# EAGLE schematic untitled (EAGLE 9.6.2)
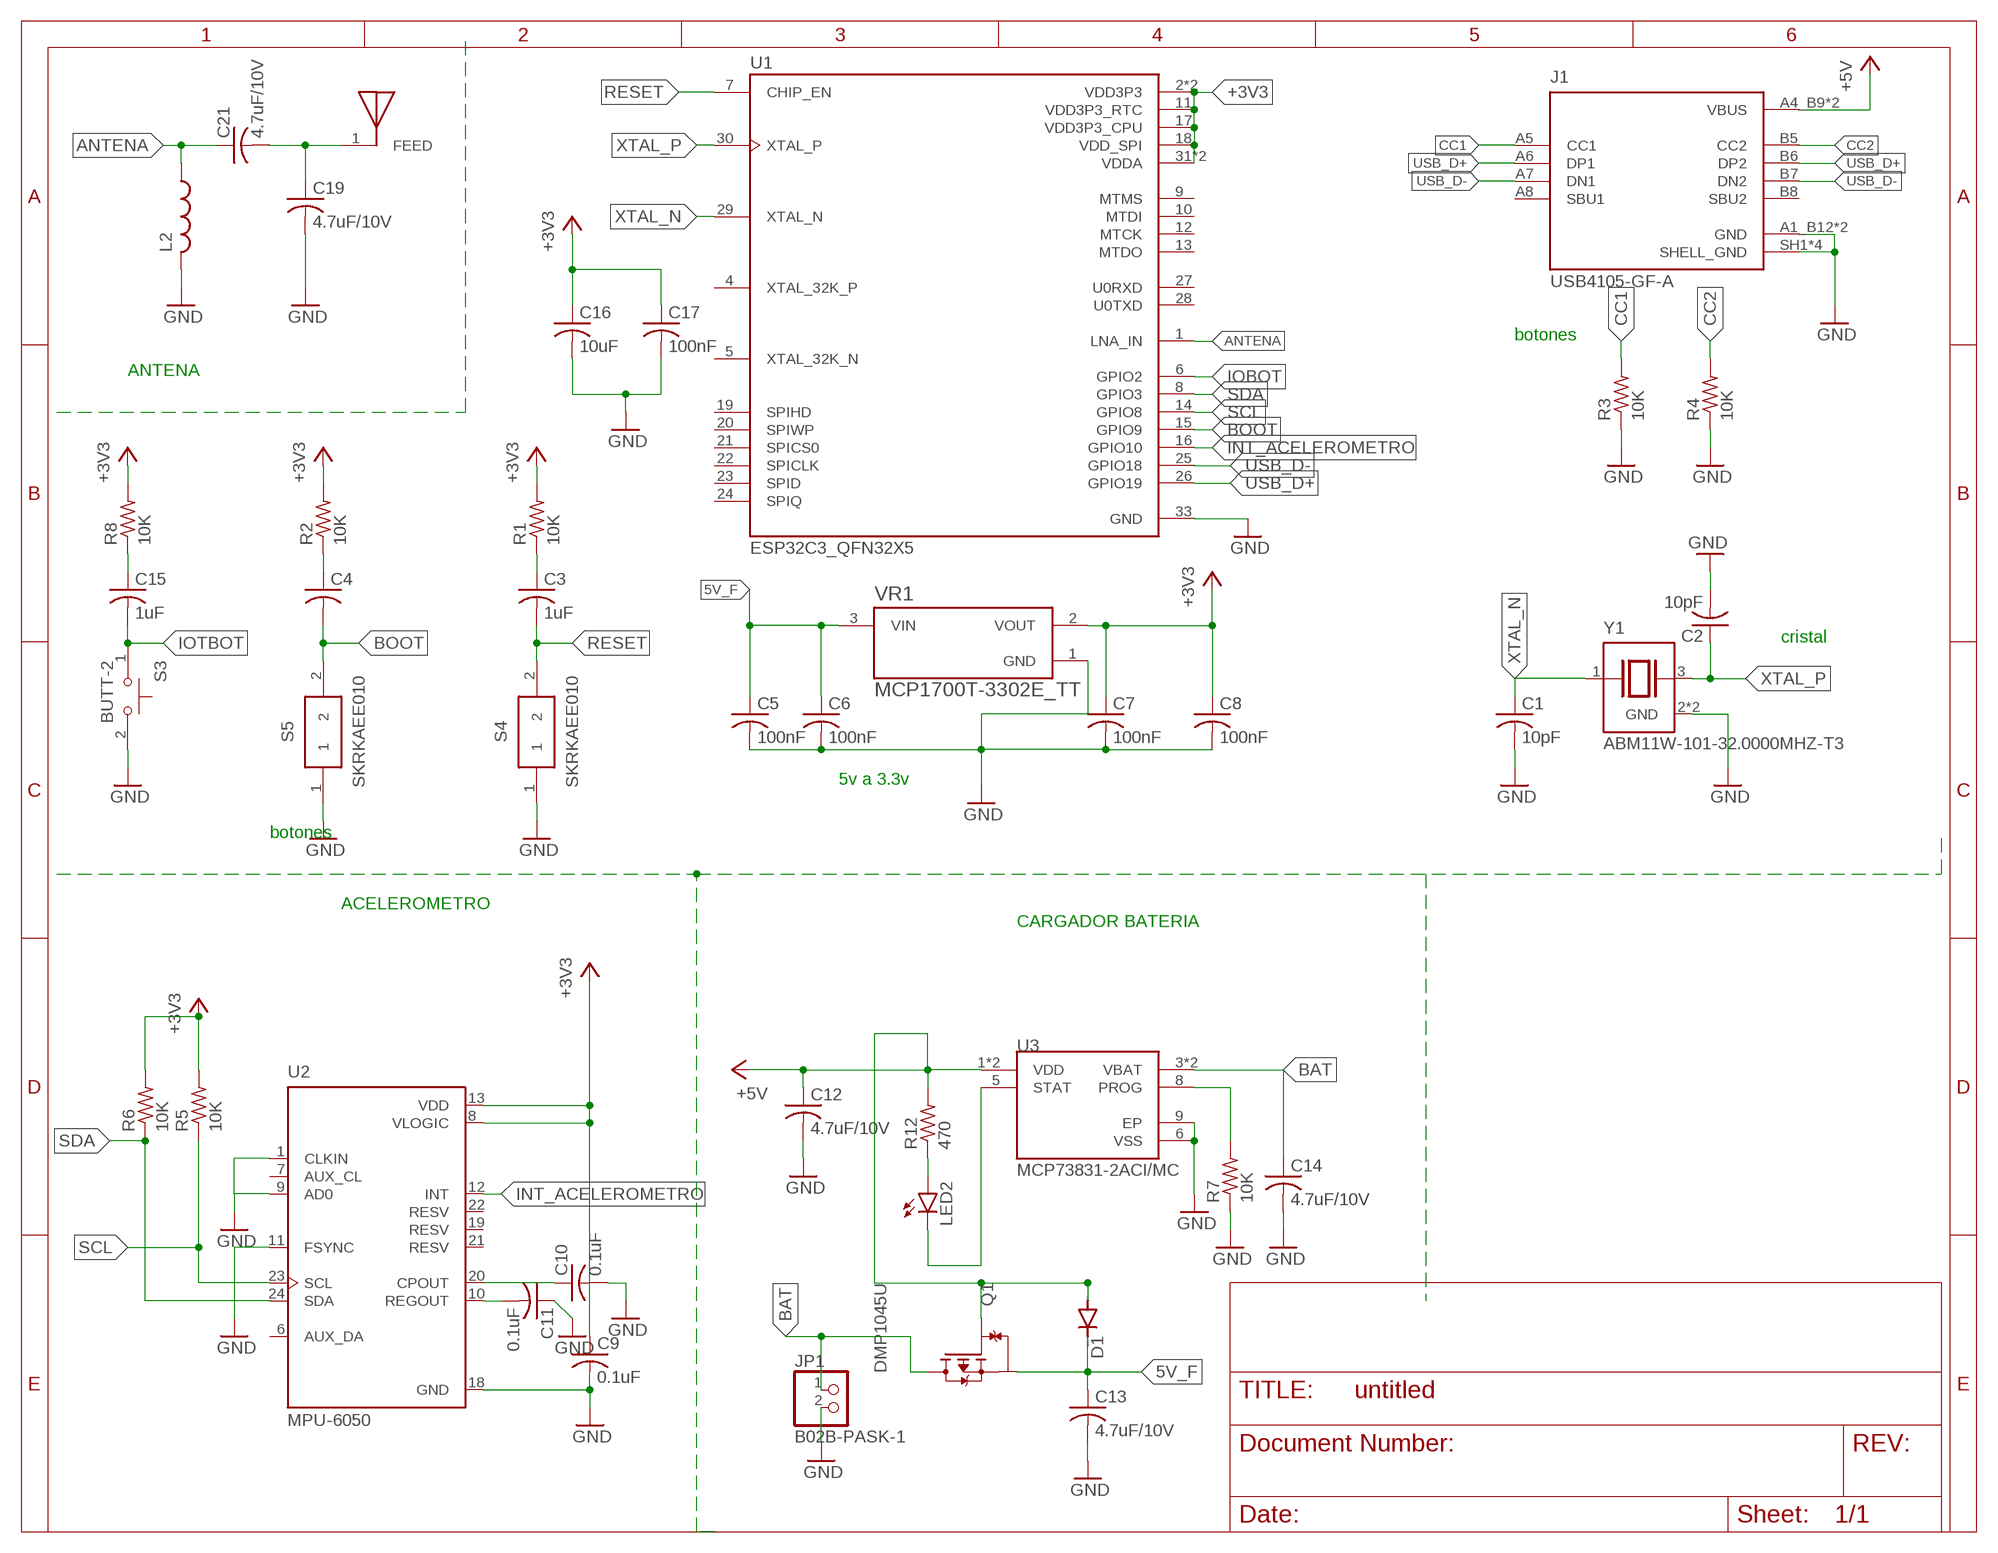
[diagram p0: schematic, sheet 1]

## Parts
C1  10pF  C-USC0603  [C0603]
C2  10pF  C-USC0603  [C0603]
C3  1uF  C-USC0603  [C0603]
C4  C-USC0603  [C0603]
C5  100nF  C-USC0603  [C0603]
C6  100nF  C-USC0603  [C0603]
C7  100nF  C-USC0603  [C0603]
C8  100nF  C-USC0603  [C0603]
C9  0.1uF  C-USC0603  [C0603]
C10  0.1uF  C-USC0603  [C0603]
C11  0.1uF  C-USC0603  [C0603]
C12  4.7uF/10V  C-USC0603  [C0603]
C13  4.7uF/10V  C-USC0603  [C0603]
C14  4.7uF/10V  C-USC0603  [C0603]
C15  1uF  C-USC0603  [C0603]
C16  10uF  C-USC0603  [C0603]
C17  100nF  C-USC0603  [C0603]
C19  4.7uF/10V  C-USC0603  [C0603]
C21  4.7uF/10V  C-USC0603  [C0603]
D1  DIODE-DO214AA  [DO214AA]
J1  USB4105-GF-A  [GCT_USB4105-GF-A]
JP1  B02B-PASK-1  [B02B-PASK-1]
L2  L-USL4516C  [L4516C]
LED2  LED  [SMARTLED-TTW]
Q1  DMP1045U  [SOT91P240X110-3N]
R1  10K  R-US_R0603  [R0603]
R2  10K  R-US_R0603  [R0603]
R3  10K  R-US_R0603  [R0603]
R4  10K  R-US_R0603  [R0603]
R5  10K  R-US_R0603  [R0603]
R6  10K  R-US_R0603  [R0603]
R7  10K  R-US_R0603  [R0603]
R8  10K  R-US_R0603  [R0603]
R12  470  R-US_R0603  [R0603]
S3  BUTT-2  [SW_BUTT-2]
S4  SKRKAEE010  [SKRK]
S5  SKRKAEE010  [SKRK]
U1  ESP32C3_QFN32X5  [QFN32_5X5MM]
U2  MPU-6050  [QFN50P400X400X95-24N]
U3  MCP73831-2ACI/MC  [SON50P200X300X100-9N]
U$1  RFANT5220110A0T  [ANTENA]
VR1  MCP1700T-3302E_TT  [SOT95P237X112-3N]
Y1  ABM11W-101-32.0000MHZ-T3  [XTAL_ABM11W-101-32.0000MHZ-T3]

## Nets
5V_F: C5.1 C6.1 C13.1 D1.C Q1.2(S) VR1.3(VIN)
+3V3: C7.1 C8.1 C9.1 C16.1 C17.1 R1.2 R2.2 R5.2 R6.2 R8.2 U1.2(VDD3P3) U1.3(VDD3P3) U1.11(VDD3P3_RTC) U1.17(VDD3P3_CPU) U1.18(VDD_SPI) U1.31(VDDA) U1.32(VDDA) U2.8(VLOGIC) U2.13(VDD) VR1.2(VOUT)
+5V: C12.1 D1.A J1.A4_B9(VBUS) J1.B4_A9(VBUS) Q1.1(G) R12.2 U3.1(VDD) U3.2(VDD)
ANTENA: U1.1(LNA_IN)
BAT: C14.1 JP1.1 Q1.3(D) U3.3(VBAT) U3.4(VBAT)
BOOT: C4.2 S5.2 U1.15(GPIO9)
CC1: J1.A5(CC1) R3.2
CC2: J1.B5(CC2) R4.2
GND: C1.2 C2.2 C5.2 C6.2 C7.2 C8.2 C9.2 C10.2 C11.1 C12.2 C13.2 C14.2 C16.2 C17.2 C19.2 J1.A1_B12(GND) J1.B1_A12(GND) J1.SH1(SHELL_GND) J1.SH2(SHELL_GND) J1.SH3(SHELL_GND) J1.SH4(SHELL_GND) JP1.2 L2.2 R3.1 R4.1 R7.1 S3.2 S4.1 S5.1 U1.33(GND) U2.1(CLKIN) U2.9(AD0) U2.11(FSYNC) U2.18(GND) U3.6(VSS) U3.9(EP) VR1.1(GND) Y1.2(GND) Y1.4(GND)
INT_ACELEROMETRO: U1.16(GPIO10) U2.12(INT)
IOBOT: U1.6(GPIO2)
IOTBOT: C15.2 S3.1
N$1: C4.1 R2.1
N$2: C3.1 R1.1
N$3: LED2.A@1(A) R12.1
N$4: LED2.C@1(C) U3.5(STAT)
N$5: R7.2 U3.8(PROG)
N$8: C11.2 U2.10(REGOUT)
N$9: C15.1 R8.1
N$10: C10.1 U2.20(CPOUT)
N$13: C21.1 L2.1
N$14: C19.1 C21.2 U$1.1(FEED)
RESET: C3.2 S4.2 U1.7(CHIP_EN)
SCL: R5.1 U1.14(GPIO8) U2.23(SCL)
SDA: R6.1 U1.8(GPIO3) U2.24(SDA)
USB_D+: J1.A6(DP1) J1.B6(DP2) U1.26(GPIO19)
USB_D-: J1.A7(DN1) J1.B7(DN2) U1.25(GPIO18)
XTAL_N: C1.1 U1.29(XTAL_N) Y1.1
XTAL_P: C2.1 U1.30(XTAL_P) Y1.3
Unconnected: J1.A8(SBU1) J1.B8(SBU2) U1.4(XTAL_32K_P) U1.5(XTAL_32K_N) U1.9(MTMS) U1.10(MTDI) U1.12(MTCK) U1.13(MTDO) U1.19(SPIHD) U1.20(SPIWP) U1.21(SPICS0) U1.22(SPICLK) U1.23(SPID) U1.24(SPIQ) U1.27(U0RXD) U1.28(U0TXD) U2.6(AUX_DA) U2.7(AUX_CL) U2.19(RESV) U2.21(RESV) U2.22(RESV)

## Notes on the sheet
- botones
- ANTENA
- cristal
- 5v a 3.3v
- botones
- ACELEROMETRO
- CARGADOR BATERIA

## Library data of the parts
C1-C17 C19 C21 = rcl:C-US: CAPACITOR, American symbol; SPICEPREFIX: C
D1 = diode:DIODE-: DIODE
J1 = USB4105-GF-A:USB4105-GF-A: Check availability <https://pricing.snapeda.com/parts/USB4105-GF-A/GCT/view-part?ref=eda>; AVAILABILITY: In Stock; CHECK_PRICES: https://www.snapeda.com/parts/USB4105-GF-A/Global+Connector+Technology/view-part/?ref=eda; DESCRIPTION: USB-C (USB TYPE-C) USB 2.0 Receptacle Connector 24 (16+8 Dummy) Position Surface Mount, Right Angle; Through Hole; MF: GCT; MP: USB4105-GF-A; PACKAGE: None; PRICE: None; PURCHASE-URL: https://www.snapeda.com/api/url_track_click_mouser/?unipart_id=4423780&manufacturer=GCT&part_name=USB4105-GF-A&search_term=usb4105 gf a; SNAPEDA_LINK: https://www.snapeda.com/parts/USB4105-GF-A/Global+Connector+Technology/view-part/?ref=snap
JP1 = B02B-PASK-1:B02B-PASK-1: Connector JST PA series, 2 pin, 2mm pitch. Check availability <https://pricing.snapeda.com/parts/B02B-PASK-1/JST%20Sales/view-part?ref=eda>; AVAILABILITY: In Stock; CHECK_PRICES: https://www.snapeda.com/parts/B02B-PASK-1/JST+Sales+America+Inc./view-part/?ref=eda; DESCRIPTION: Connector Header Through Hole 2 position 0.079 (2.00mm); MF: JST Sales; MP: B02B-PASK-1; PACKAGE: None; PRICE: None; SNAPEDA_LINK: https://www.snapeda.com/parts/B02B-PASK-1/JST+Sales+America+Inc./view-part/?ref=snap
L2 = rcl:L-US: INDUCTOR, American symbol; SPICEPREFIX: L
LED2 = led:LED: LED OSRAM: - CHIPLED LG R971, LG N971, LY N971, LG Q971, LY Q971, LO R971, LY R971 LH N974, LH R974 LS Q976, LO Q976, LY Q976 LO Q996 - Hyper CHIPLED LW Q18S LB Q993, LB Q99A, LB R99A - SideLED LS A670, LO A670, LY A670, LG A670, LP A670 LB A673, LV A673, LT A673, LW A673 LH A674 LY A675 LS A676, LA A676, LO A676, LY A676, LW A676 LS A679, LY A679, LG A679 - Hyper Micro SIDELED® LS Y876, LA Y876, LO Y876, LY Y876 LT Y87S - SmartLED LW L88C, LW L88S LB L89C, LB L89S, LG L890 LS L89K, LO L89K, LY L89K LS L896, LA L896, LO L896, LY L896 - TOPLED LS T670, LO T670, LY T670, LG T670, LP T670 LSG T670, LSP T670, LSY T670, LOP T670, LYG T670 LG T671, LOG T671, LSG T671 LB T673, LV T673, LT T673, LW T673 LH T674 LS T676, LA T676, LO T676, LY T676, LB T676, LH T676, LSB T676, LW T676 LB T67C, LV T67C, LT T67C, LS T67K, LO T67K, LY T67K, LW E67C LS E67B, LA E67B, LO E67B, LY E67B, LB E67C, LV E67C, LT E67C LW T67C LS T679, LY T679, LG T679 LS T770, LO T770, LY T770, LG T770, LP T770 LB T773, LV T773, LT T773, LW T773 LH T774 LS E675, LA E675, LY E675, LS T675 LS T776, LA T776, LO T776, LY T776, LB T776 LHGB T686 LT T68C, LB T68C - Hyper Mini TOPLED® LB M676 - Mini TOPLED Santana® LG M470 LS M47K, LO M47K, LY M47K Source: http://www.osram.convergy.de LUXEON: - LUMILED® LXK2-PW12-R00, LXK2-PW12-S00, LXK2-PW14-U00, LXK2-PW14-V00 LXK2-PM12-R00, LXK2-PM12-S00, LXK2-PM14-U00 LXK2-PE12-Q00, LXK2-PE12-R00, LXK2-PE12-S00, LXK2-PE14-T00, LXK2-PE14-U00 LXK2-PB12-K00, LXK2-PB12-L00, LXK2-PB12-M00, LXK2-PB14-N00, LXK2-PB14-P00, LXK2-PB14-Q00 LXK2-PR12-L00, LXK2-PR12-M00, LXK2-PR14-Q00, LXK2-PR14-R00 LXK2-PD12-Q00, LXK2-PD12-R00, LXK2-PD12-S00 LXK2-PH12-R00, LXK2-PH12-S00 LXK2-PL12-P00, LXK2-PL12-Q00, LXK2-PL12-R00 Source: www.luxeon.com KINGBRIGHT: KA-3528ASYC Source: www.kingbright.com
Q1 = DMP1045U:DMP1045U: P-Channel 12V 4A (Ta) 800mW (Ta) Surface Mount SOT-23 Check availability <https://pricing.snapeda.com/parts/DMP1045U/Diodes%20Inc./view-part?ref=eda>; AVAILABILITY: In Stock; CHECK_PRICES: https://www.snapeda.com/parts/DMP1045U/Diodes+Inc./view-part/?ref=eda; DESCRIPTION: P-Channel 12 V 2.6A (Ta) 530mW Surface Mount X2-WLB0808-4 (Type C); MF: Diodes Inc.; MP: DMP1045U; PACKAGE: SOT-23 Diodes Inc.; PRICE: None; SNAPEDA_LINK: https://www.snapeda.com/parts/DMP1045U/Diodes+Inc./view-part/?ref=snap
R1-R8 R12 = rcl:R-US_: RESISTOR, American symbol; SPICEPREFIX: R
S3 = BUTT-2:BUTT-2: Tactile Switches MINI PUSH BUTTON SWITCH 2-PIN QTY. 4 Check availability <https://pricing.snapeda.com/parts/BUTT-2/Gravitech/view-part?ref=eda>; AVAILABILITY: In Stock; CHECK_PRICES: https://www.snapeda.com/parts/BUTT-2/Gravitech/view-part/?ref=eda; DESCRIPTION: Tactile Switches MINI PUSH BUTTON SWITCH 2-PIN QTY. 4; MF: Gravitech; MP: BUTT-2; PACKAGE: None; PRICE: None; SNAPEDA_LINK: https://www.snapeda.com/parts/BUTT-2/Gravitech/view-part/?ref=snap
S4 S5 = SKRKAEE010:SKRKAEE010: Tactile Switches 3.9x2.9x2.0mm 160gf Packaging Temp 60oC <https://componentsearchengine.com/Images/1/SKRKAEE010.jpg> Source: Datasheet <http://www.mouser.com/ds/2/15/SKRK-1110686.pdf> Check availability <https://pricing.snapeda.com/parts/SKRKAEE010/ALPS/view-part?ref=eda>; AVAILABILITY: In Stock; CHECK_PRICES: https://www.snapeda.com/parts/SKRKAEE010/ALPS/view-part/?ref=eda; DESCRIPTION: Switch Tactile N.O. SPST Round Button Gull Wing 0.05A 12VDC 1.57N SMD T/R; MF: ALPS; MP: SKRKAEE010; PACKAGE: None; PRICE: None; SNAPEDA_LINK: https://www.snapeda.com/parts/SKRKAEE010/ALPS/view-part/?ref=snap
U1 = ESP32C3:ESP32C3: Check availability <https://pricing.snapeda.com/parts/ESP32-C3/Espressif%20Systems/view-part?ref=eda>; AVAILABILITY: In Stock; CHECK_PRICES: https://www.snapeda.com/parts/ESP32-C3/Espressif+Systems/view-part/?ref=eda; DESCRIPTION: WiFi Modules (802.11) (Engineering Samples Only) SMD IC ESP32-C3, RISC-V single-core MCU, 2.4G Wi-Fi & BLE 5.0 combo, QFN 32-pin, 5*5 mm, 40 ~ 105C; MF: Espressif Systems; MP: ESP32-C3; PACKAGE: VFQFN-32 Espressif Systems; PRICE: None; PURCHASE-URL: https://www.snapeda.com/api/url_track_click_mouser/?unipart_id=5833677&manufacturer=Espressif Systems&part_name=ESP32-C3&search_term=esp32 c3; SNAPEDA_LINK: https://www.snapeda.com/parts/ESP32-C3/Espressif+Systems/view-part/?ref=snap
U2 = MPU-6050:MPU-6050: MPU-6050 Six-Axis (Gyro + Accelerometer) MEMS MotionTracking™ Devices Check availability <https://pricing.snapeda.com/parts/MPU-6050/TDK%20InvenSense/view-part?ref=eda>; AVAILABILITY: In Stock; CHECK_PRICES: https://www.snapeda.com/parts/MPU-6050/TDK+InvenSense/view-part/?ref=eda; DESCRIPTION: MPU-6050 series Accelerometer, Gyroscope, 3 Axis Sensor Evaluation Board; MF: TDK InvenSense; MP: MPU-6050; PACKAGE: QFN-24 InvenSense; PRICE: None; PURCHASE-URL: https://www.snapeda.com/api/url_track_click_mouser/?unipart_id=43944&manufacturer=TDK InvenSense&part_name=MPU-6050&search_term=mpu6050; SNAPEDA_LINK: https://www.snapeda.com/parts/MPU-6050/TDK+InvenSense/view-part/?ref=snap
U3 = MCP73831-2ACI_MC:MCP73831-2ACI/MC: MCP73831 Series Single-Cell Li-Ion/Li-Polymer Battery Charge Controller - DFN-8 Check availability <https://pricing.snapeda.com/parts/MCP73831-2ACI/MC/Microchip/view-part?ref=eda>; AVAILABILITY: In Stock; CHECK_PRICES: https://www.snapeda.com/parts/MCP73831-2ACI/MC/Microchip/view-part/?ref=eda; DESCRIPTION: Charge Controller Li-Ion/Li-Pol 15mA to 500mA 4.2V 8-Pin DFN EP | Microchip Technology Inc. MCP73831-2ACI/MC; MF: Microchip; MP: MCP73831-2ACI/MC; PACKAGE: VFDFN-8 Microchip; PRICE: None; SNAPEDA_LINK: https://www.snapeda.com/parts/MCP73831-2ACI/MC/Microchip/view-part/?ref=snap
U$1 = untitled:RFANT5220110A0T
VR1 = MCP1700T-3302E_TT:MCP1700T-3302E_TT: Check availability <https://pricing.snapeda.com/parts/MCP1700T-3302E/TT/Microchip/view-part?ref=eda>; AVAILABILITY: In Stock; CHECK_PRICES: https://www.snapeda.com/parts/MCP1700T-3302E/TT/Microchip/view-part/?ref=eda; DESCRIPTION: Pwr Sply Func,Voltage Regulator,LDO,SOT-23,PD 369.6mW,VO 3.3V,Regline +/-0.75%/V | Microchip Technology Inc. MCP1700T-3302E/TT; MF: Microchip; MP: MCP1700T-3302E/TT; PACKAGE: SOT-23 Microchip; PRICE: None; PURCHASE-URL: https://www.snapeda.com/api/url_track_click_mouser/?unipart_id=8101&manufacturer=Microchip&part_name=MCP1700T-3302E/TT&search_term=mcp1700; SNAPEDA_LINK: https://www.snapeda.com/parts/MCP1700T-3302E/TT/Microchip/view-part/?ref=snap
Y1 = ABM11W-101-32.0000MHZ-T3:ABM11W-101-32.0000MHZ-T3: Check availability <https://pricing.snapeda.com/parts/ABM11W-101-32.0000MHZ-T3/Abracon%20LLC/view-part?ref=eda>; AVAILABILITY: In Stock; CHECK_PRICES: https://www.snapeda.com/parts/ABM11W-101-32.0000MHZ-T3/Abracon+LLC/view-part/?ref=eda; DESCRIPTION: IoT OPTIMIZED LOW PROFILE QUARTZ CRYSTAL; MF: Abracon LLC; MP: ABM11W-101-32.0000MHZ-T3; PACKAGE: SMD-4 Abracon LLC; PRICE: None; SNAPEDA_LINK: https://www.snapeda.com/parts/ABM11W-101-32.0000MHZ-T3/Abracon+LLC/view-part/?ref=snap